# EAGLE design humidor_controller_v33 (EAGLE 6.2)
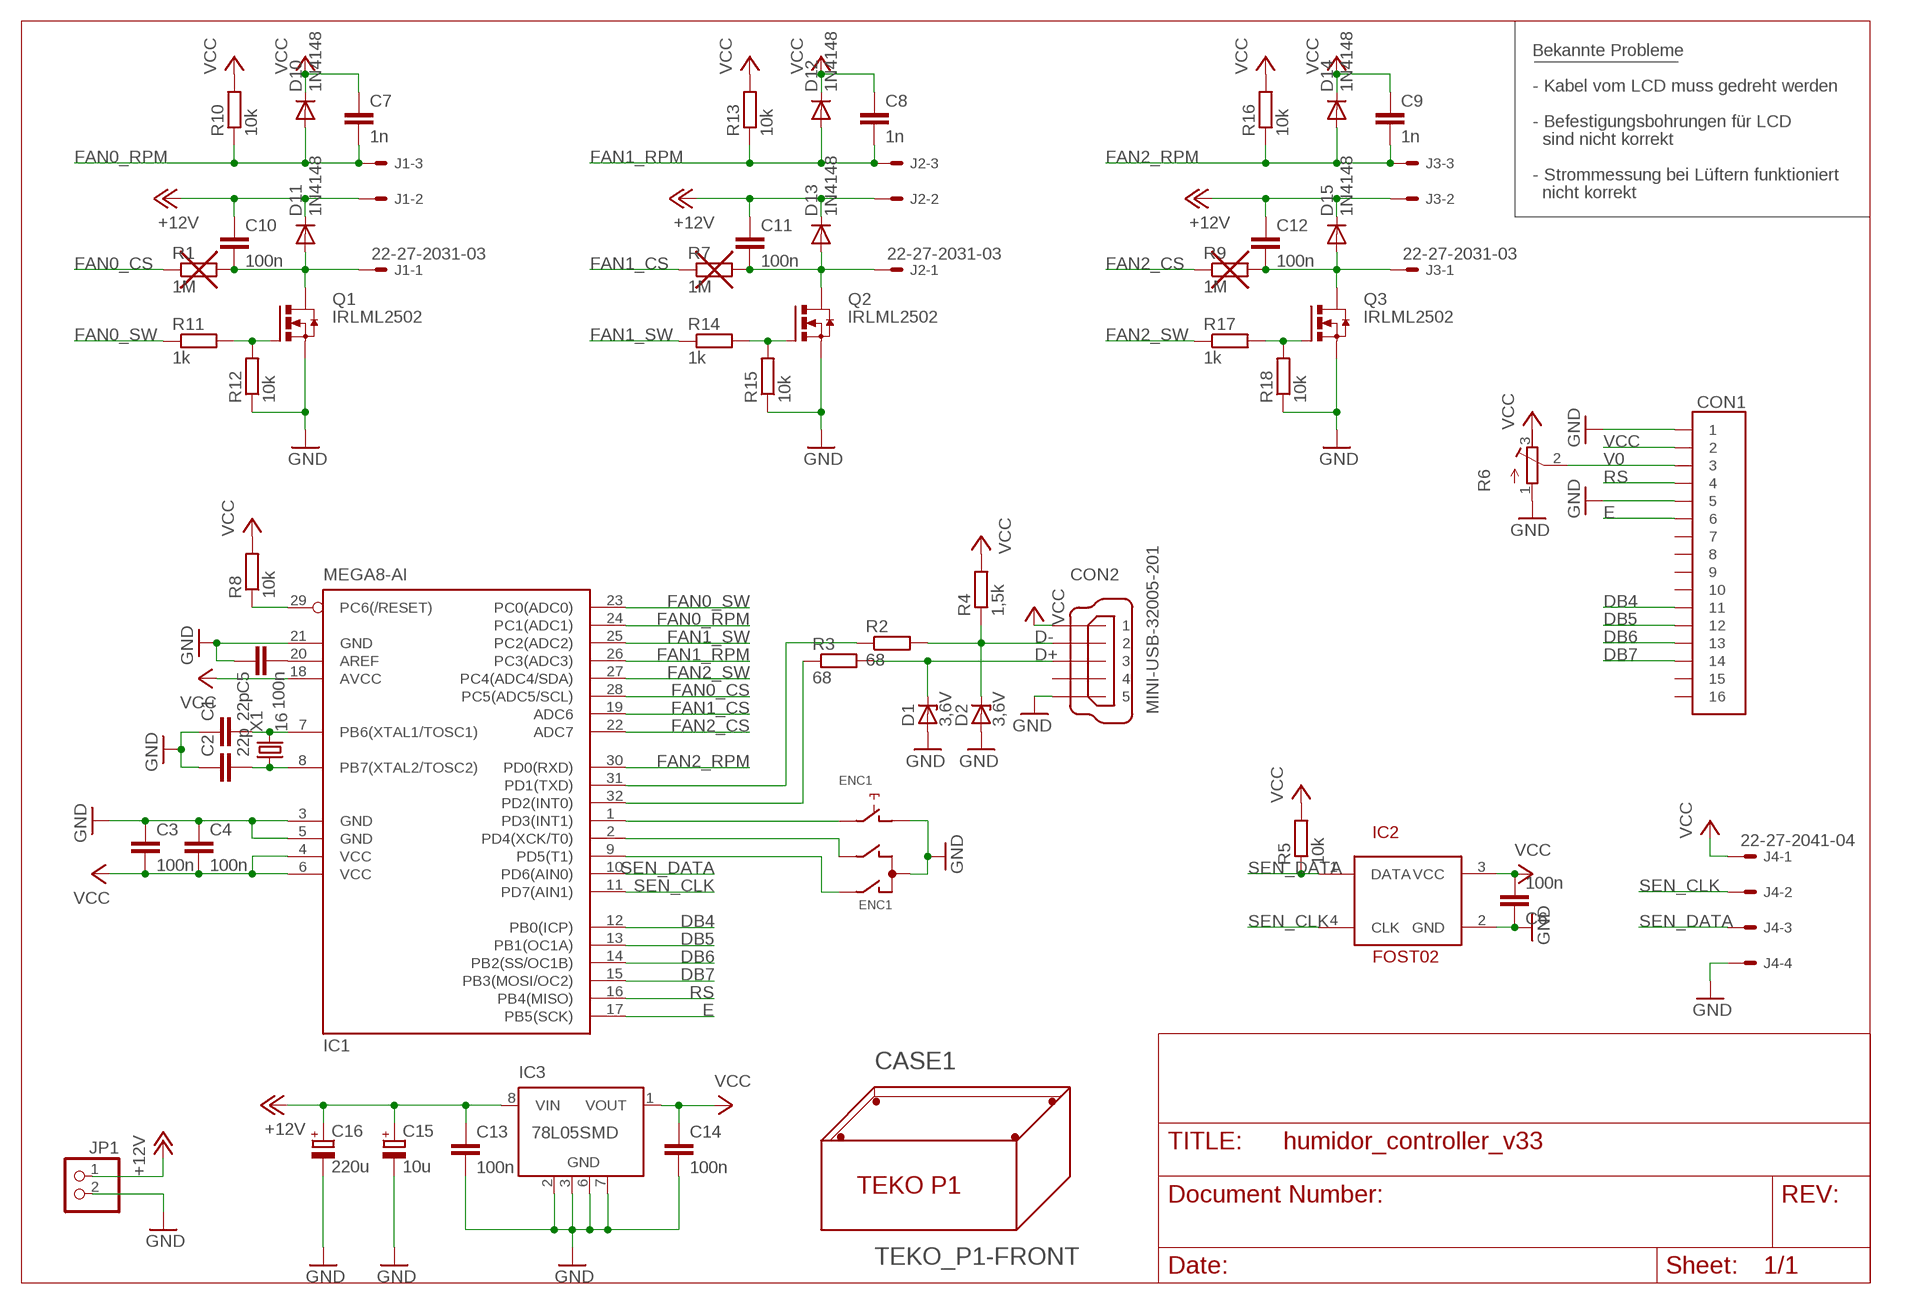
[diagram p0: schematic, sheet 1]

## Parts
C1  22p  C-EUC0805  [C0805]
C2  22p  C-EUC0805  [C0805]
C3  100n  C-EUC0805  [C0805]
C4  100n  C-EUC0805  [C0805]
C5  100n  C-EUC0805  [C0805]
C6  100n  C-EUC0805  [C0805]
C7  1n  C-EUC0805  [C0805]
C8  1n  C-EUC0805  [C0805]
C9  1n  C-EUC0805  [C0805]
C10  100n  C-EUC0805  [C0805]
C11  100n  C-EUC0805  [C0805]
C12  100n  C-EUC0805  [C0805]
C13  100n  C-EUC0805  [C0805]
C14  100n  C-EUC0805  [C0805]
C15  10u  CPOL-EUD  [PANASONIC_D]
C16  220u  CPOL-EUG  [PANASONIC_G]
CASE1  TEKO_P1-FRONT  [TEKO_P1_FRONT]
CON1  52207-16  [52207-16]
CON2  MINI-USB-32005-201  [32005-201]
D1  3,6V  ZENER-DIODESOD80C  [SOD80C]
D2  3,6V  ZENER-DIODESOD80C  [SOD80C]
D10  1N4148  DIODE-SOD323-R  [SOD323-R]
D11  1N4148  DIODE-SOD323-R  [SOD323-R]
D12  1N4148  DIODE-SOD323-R  [SOD323-R]
D13  1N4148  DIODE-SOD323-R  [SOD323-R]
D14  1N4148  DIODE-SOD323-R  [SOD323-R]
D15  1N4148  DIODE-SOD323-R  [SOD323-R]
ENC1  NOBLE_RE0124  [RE0124]
IC1  MEGA8-AI  [TQFP32-08]
IC2  FOST02  [FOST02]
IC3  78L05SMD  [SO08]
J1  22-27-2031-03  [6410-03]
J2  22-27-2031-03  [6410-03]
J3  22-27-2031-03  [6410-03]
J4  22-27-2041-04  [6410-04]
JP1  PINHD-1X2  [1X02]
Q1  IRLML2502  N-HEXFET_SOT23-IRLML2502  [SOT23]
Q2  IRLML2502  N-HEXFET_SOT23-IRLML2502  [SOT23]
Q3  IRLML2502  N-HEXFET_SOT23-IRLML2502  [SOT23]
R1  1M  R-EU_R0805  [R0805]
R2  68  R-EU_R0805  [R0805]
R3  68  R-EU_R0805  [R0805]
R4  1,5k  R-EU_R0805  [R0805]
R5  10k  R-EU_R0805  [R0805]
R6  R-TRIMM4G/J  [RTRIM4G/J]
R7  1M  R-EU_R0805  [R0805]
R8  10k  R-EU_R0805  [R0805]
R9  1M  R-EU_R0805  [R0805]
R10  10k  R-EU_R0805  [R0805]
R11  1k  R-EU_R0805  [R0805]
R12  10k  R-EU_R0805  [R0805]
R13  10k  R-EU_R0805  [R0805]
R14  1k  R-EU_R0805  [R0805]
R15  10k  R-EU_R0805  [R0805]
R16  10k  R-EU_R0805  [R0805]
R17  1k  R-EU_R0805  [R0805]
R18  10k  R-EU_R0805  [R0805]
X1  16  CRYSTALHC49UP  [HC49UP]

## Nets
+12V: C10.1 C11.1 C12.1 C13.1 C15.+ C16.+ D11.C D13.C D15.C IC3.8(VIN) J1.2 J2.2 J3.2 JP1.1
D+: CON2.3 D1.C R3.2
D-: CON2.2 D2.C R2.2 R4.1
DB4: CON1.11 IC1.12(PB0(ICP))
DB5: CON1.12 IC1.13(PB1(OC1A))
DB6: CON1.13 IC1.14(PB2(SS/OC1B))
DB7: CON1.14 IC1.15(PB3(MOSI/OC2))
E: CON1.6 IC1.17(PB5(SCK))
FAN0_CS: IC1.28(PC5(ADC5/SCL)) R1.1
FAN0_CS_: C10.2 D11.A J1.1 Q1.3(D) R1.2
FAN0_RPM: C7.2 D10.A IC1.24(PC1(ADC1)) J1.3 R10.1
FAN0_SW: IC1.23(PC0(ADC0)) R11.1
FAN1_CS: IC1.19(ADC6) R7.1
FAN1_CS_: C11.2 D13.A J2.1 Q2.3(D) R7.2
FAN1_RPM: C8.2 D12.A IC1.26(PC3(ADC3)) J2.3 R13.1
FAN1_SW: IC1.25(PC2(ADC2)) R14.1
FAN2_CS: IC1.22(ADC7) R9.1
FAN2_CS_: C12.2 D15.A J3.1 Q3.3(D) R9.2
FAN2_RPM: C9.2 D14.A IC1.30(PD0(RXD)) J3.3 R16.1
FAN2_SW: IC1.27(PC4(ADC4/SDA)) R17.1
GND: C1.1 C2.1 C3.1 C4.1 C5.1 C6.1 C13.2 C14.2 C15.- C16.- CON1.1 CON1.5 CON2.5 D1.A D2.A ENC1.+ ENC1.C IC1.3(GND) IC1.5(GND) IC1.21(GND) IC2.2(GND) IC3.2(GND) IC3.3(GND) IC3.6(GND) IC3.7(GND) J4.4 JP1.2 Q1.2(S) Q2.2(S) Q3.2(S) R6.1(E) R12.1 R15.1 R18.1
N$1: IC1.29(PC6(/RESET)) R8.1
N$2: C2.2 IC1.8(PB7(XTAL2/TOSC2)) X1.1
N$3: C1.2 IC1.7(PB6(XTAL1/TOSC1)) X1.2
N$4: Q2.1(G) R14.2 R15.2
N$5: Q3.1(G) R17.2 R18.2
N$7: C5.2 IC1.20(AREF)
N$9: Q1.1(G) R11.2 R12.2
N$11: IC1.31(PD1(TXD)) R2.1
N$13: ENC1.- IC1.1(PD3(INT1))
N$14: ENC1.B IC1.2(PD4(XCK/T0))
N$15: ENC1.A IC1.9(PD5(T1))
N$16: IC1.32(PD2(INT0)) R3.1
RS: CON1.4 IC1.16(PB4(MISO))
SEN_CLK: IC1.11(PD7(AIN1)) IC2.4(CLK) J4.2
SEN_DATA: IC1.10(PD6(AIN0)) IC2.1(DATA) J4.3 R5.1
V0: CON1.3 R6.2(S)
VCC: C3.2 C4.2 C6.2 C7.1 C8.1 C9.1 C14.1 CON1.2 CON2.1 D10.C D12.C D14.C IC1.4(VCC) IC1.6(VCC) IC1.18(AVCC) IC2.3(VCC) IC3.1(VOUT) J4.1 R4.2 R5.2 R6.3(A) R8.2 R10.2 R13.2 R16.2
Unconnected: CON1.7 CON1.8 CON1.9 CON1.10 CON1.15 CON1.16 CON2.4 IC3.4(NC) IC3.5(NC)

## Notes on the sheet
- Bekannte Probleme
- - Kabel vom LCD muss gedreht werden
- - Befestigungsbohrungen für LCD
- sind nicht korrekt
- - Strommessung bei Lüftern funktioniert
- nicht korrekt

## Library data of the parts
C1 C2 C13 C14 = rcl:C-EU: CAPACITOR, European symbol
C3-C12 = resistor:C-EU: CAPACITOR, European symbol
C15 C16 = rcl:CPOL-EU: POLARIZED CAPACITOR, European symbol
CASE1 = ferdinandkeil:TEKO_P1-: TEKO P1 Case - Serie Optative 85 x 56 x 35 mm
CON1 = jt-con-molex:52207-16: Molex 52207-16 top-connection FPC 1mm
CON2 = con-cypressindustries:MINI-USB-: MINI USB-B Conector Source: www.cypressindustries.com
D1 D2 = diode:ZENER-DIODE: Z-Diode
D10-D15 = ferdinandkeil:DIODE-: DIODE
ENC1 = ferdinandkeil:NOBLE_RE0124: NOBLE RE0124 Rotary Encoder w/ Push-Button
IC1 = atmel:MEGA8: MICROCONTROLLER 8 Kbytes FLASH, 1 kbytes SRAM, 512 bytes EEPROM, USART, 6-channel 10 bit ADC, 2-channel 8 bit ADC Pin compatible with Atmega48, ATMega88, ATMega168 Source: avr.lbr
IC2 = ferdinandkeil:FOST02
IC3 = linear:78L*SMD: Positive VOLTAGE REGULATOR
J1-J3 = con-molex:22-?-03: CONNECTOR wire to board 2.54 mm (.1 inch) pitch header
J4 = con-molex:22-?-04: CONNECTOR wire to board 2.54 mm (.1 inch) pitch header
JP1 = pinhead:PINHD-1X2: PIN HEADER
Q1-Q3 = ferdinandkeil:N-HEXFET_?-*: HEXFET® Power MOSFET
R1-R5 R7-R18 = resistor:R-EU_: RESISTOR, European symbol
R6 = rcl:R-TRIMM: Trimm resistor
X1 = crystal:CRYSTAL: CRYSTAL

## Board
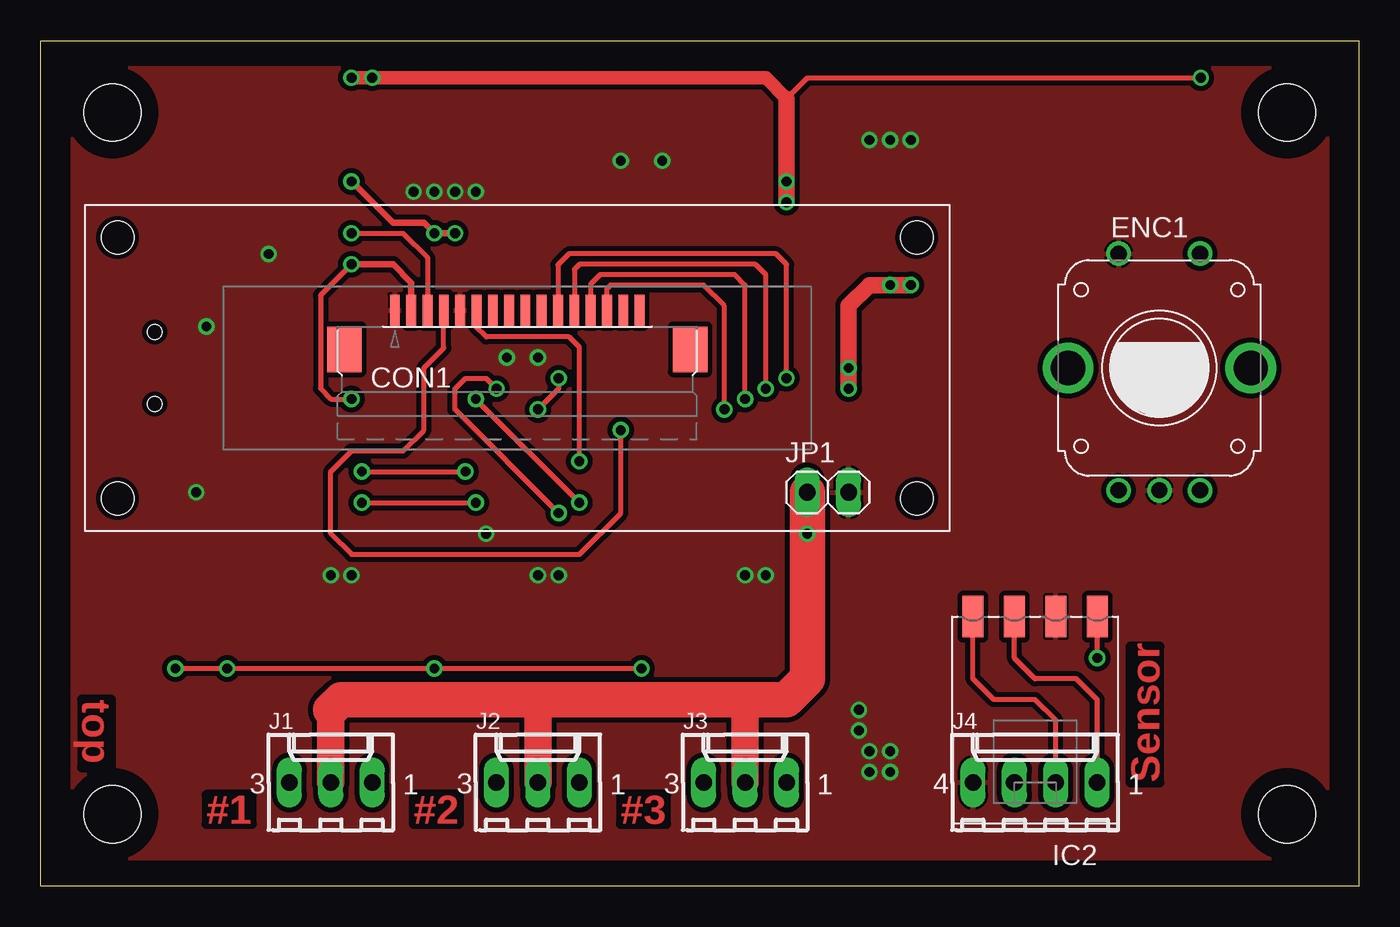
[diagram p1: board, top side]
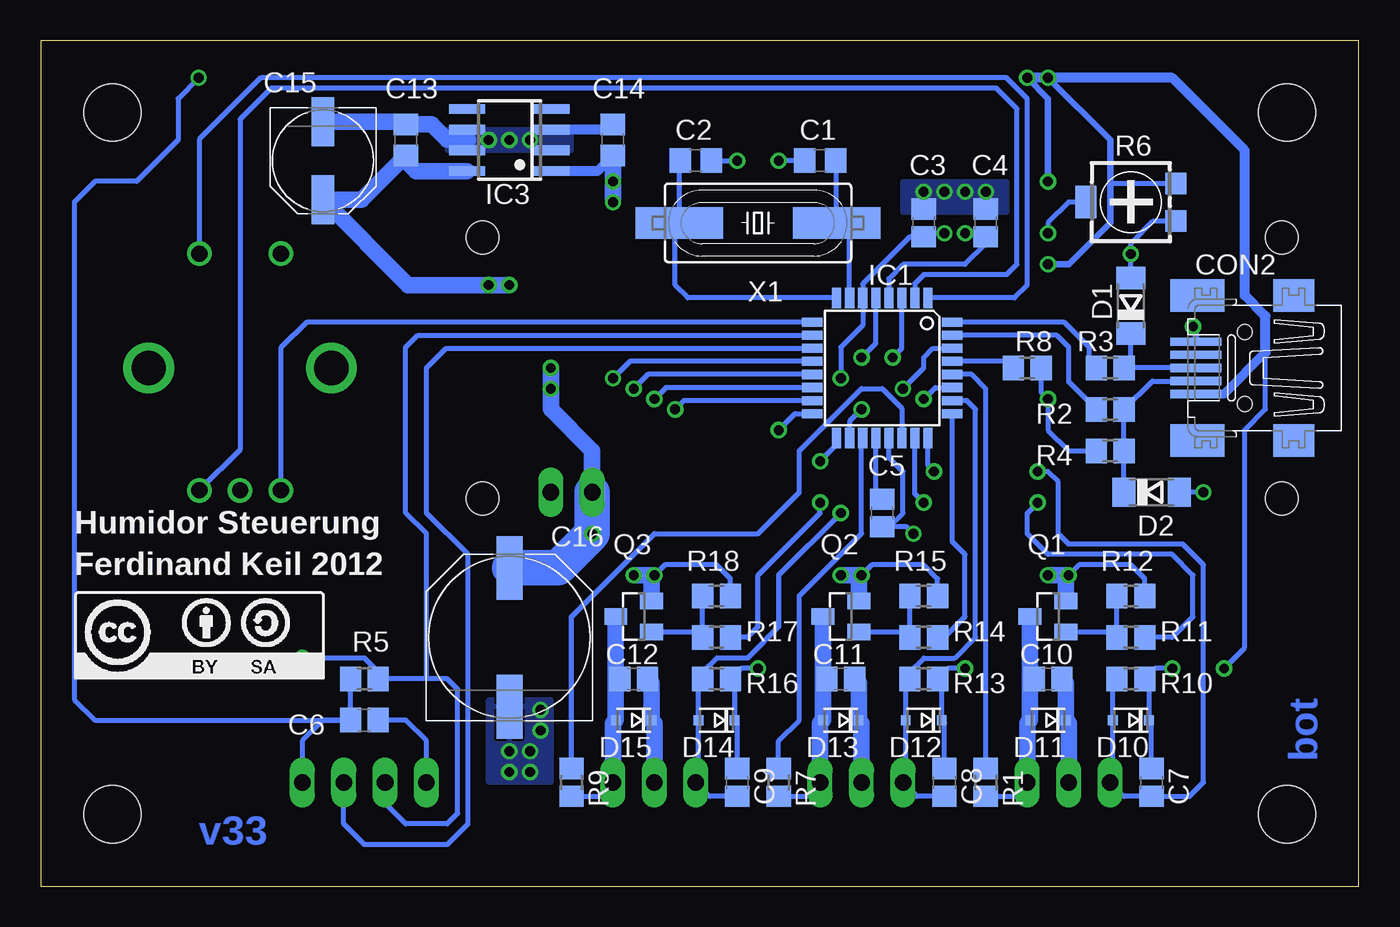
[diagram p2: board, bottom side, seen from below]

Size 80.8 x 51.8 mm. Coordinates in mm from the lower left corner, seen from the top.
Copper layers (1*16): Top 0.035mm / dielectric 1.5mm / Bottom 0.035mm
Design rules: minimum track width 0.15mm, minimum drill 0.3mm, track to track 0.15mm, track to pad 0.15mm, pad to pad 0.15mm, via to via 0.15mm, smd to smd 0mil, copper to edge 0.2mm, drill to drill 0.2mm, minimum pad ring 0.2mm, minimum via ring 0.2mm, stop-mask expansion 4mil, vias tented up to drill 0.8mm, thermal gap 0.15mm

### Footprints (pad centres in the part's own frame; a part is rotated, then mirrored left to right if it is on the bottom)
C0805 = smd 1.3 x 1.5: 1 -0.95,0; 2 0.95,0
C0805' = smd 1.3 x 1.5: 1 -0.85,0; 2 0.85,0
PANASONIC_D = smd 3 x 1.4: + 2.4,0; - -2.4,0
PANASONIC_G = smd 3.9 x 1.6: + 4.25,0; - -4.25,0
TEKO_P1_FRONT = hole 3.5: 4.4,4.4; 4.4,47.4; 76.4,4.4; 76.4,47.4
52207-16 = smd 0.6 x 1.9: 1 -7.5,1; 2 -6.5,1; 3 -5.5,1; 4 -4.5,1; 5 -3.5,1; 6 -2.5,1; 7 -1.5,1; 8 -0.5,1; 9 0.5,1; 10 1.5,1; 11 2.5,1; 12 3.5,1; 13 4.5,1; 14 5.5,1; 15 6.5,1; 16 7.5,1 | smd 2.1 x 2.8: P$1 -10.6,-1.4; P$2 10.6,-1.4
32005-201 = smd 3.1 x 0.5: 1 3,1.6; 2 3,0.8; 3 3,0; 4 3,-0.8; 5 3,-1.6 | smd 2.5 x 2: M1 -3,-4.45; M2 -3,4.45 | smd 3.3 x 2: M3 2.9,4.45; M4 2.9,-4.45 | hole 0.9: 0,2.2; 0,-2.2
SOD80C = smd 1.4 x 1.8: A 1.7,0; C -1.7,0
SOD323-R = smd 0.6 x 0.6: A 1.1,0; C -1.1,0
RE0124 = drill 1: + -2.5,7; - 2.5,7; A -2.5,-7.5; B 2.5,-7.5; C 0,-7.5 | drill 2.1: P$1 5.6,0; P$2 -5.6,0
TQFP32-08 = smd 1.27 x 0.559: 1 -4.293,2.8; 2 -4.293,2; 3 -4.293,1.2; 4 -4.293,0.4; 5 -4.293,-0.4; 6 -4.293,-1.2; 7 -4.293,-2; 8 -4.293,-2.8; 17 4.293,-2.8; 18 4.293,-2; 19 4.293,-1.2; 20 4.293,-0.4; 21 4.293,0.4; 22 4.293,1.2; 23 4.293,2; 24 4.293,2.8 | smd 0.559 x 1.27: 9 -2.8,-4.293; 10 -2,-4.293; 11 -1.2,-4.293; 12 -0.4,-4.293; 13 0.4,-4.293; 14 1.2,-4.293; 15 2,-4.293; 16 2.8,-4.293; 25 2.8,4.293; 26 2,4.293; 27 1.2,4.293; 28 0.4,4.293; 29 -0.4,4.293; 30 -1.2,4.293; 31 -2,4.293; 32 -2.8,4.293
FOST02 = smd 1.27 x 2.54: 1 -3.81,-10.16; 2 -1.27,-10.16; 3 1.27,-10.16; 4 3.81,-10.16
SO08 = smd 0.6 x 2.2: 1 -1.905,-2.6; 2 -0.635,-2.6; 3 0.635,-2.6; 4 1.905,-2.6; 5 1.905,2.6; 6 0.635,2.6; 7 -0.635,2.6; 8 -1.905,2.6
6410-03 = drill 1.016 long: 1 2.54,0; 2 0,0; 3 -2.54,0
6410-04 = drill 1.016 long: 1 3.81,0; 2 1.27,0; 3 -1.27,0; 4 -3.81,0
1X02 = drill 1.016 long: 1 -1.27,0; 2 1.27,0
SOT23 = smd 1 x 1.4: 1 -0.95,-1.1; 2 0.95,-1.1; 3 0,1.1
R0805 = smd 1.3 x 1.5: 1 -0.85,0; 2 0.85,0
RTRIM4G/J = smd 1.3 x 1.3: 1 -1.15,-2.75; 3 1.15,-2.75 | smd 2 x 1.3: 2 0,2.75
LCD_HMC16223SG = hole 2: -24.5,-8; -24.5,8; 24.5,8; 24.5,-8
HC49UP = smd 5.334 x 1.93: 1 -4.826,0; 2 4.826,0

### Placement (x,y rotation side)
C1  33.02,44.45 0 bottom
C2  40.64,44.45 180 bottom
C3  100n  [C0805']  26.67,40.64 270 bottom
C4  100n  [C0805']  22.86,40.64 270 bottom
C5  100n  [C0805']  29.21,22.86 90 bottom
C6  100n  [C0805']  60.96,10.16 180 bottom
C7  1n  [C0805']  12.7,6.35 270 bottom
C8  1n  [C0805']  25.4,6.35 270 bottom
C9  1n  [C0805']  38.1,6.35 270 bottom
C10  100n  [C0805']  19.05,12.7 180 bottom
C11  100n  [C0805']  31.75,12.7 180 bottom
C12  100n  [C0805']  44.45,12.7 180 bottom
C13  58.42,45.72 90 bottom
C14  45.72,45.72 90 bottom
C15  63.5,44.45 270 bottom
C16  52.07,15.24 90 bottom
CASE1  0,0 0 top
CON1  29.21,34.29 0 top
CON2  6.99,31.75 180 bottom
D1  13.97,35.56 90 bottom
D2  12.7,24.13 0 bottom
D10  13.97,10.16 180 bottom
D11  19.05,10.16 180 bottom
D12  26.67,10.16 180 bottom
D13  31.75,10.16 180 bottom
D14  39.37,10.16 180 bottom
D15  44.45,10.16 180 bottom
ENC1  68.58,31.75 0 top
IC1  29.21,31.75 270 bottom
IC2  60.96,6.35 180 top
IC3  52.07,45.72 90 bottom
J1  17.78,6.35 0 top
J2  30.48,6.35 0 top
J3  43.18,6.35 0 top
J4  60.96,6.35 0 top
JP1  48.26,24.13 0 top
Q1  19.05,16.51 90 bottom
Q2  31.75,16.51 90 bottom
Q3  44.45,16.51 90 bottom
R1  22.86,6.35 270 bottom
R2  15.24,29.21 0 bottom
R3  15.24,31.75 0 bottom
R4  15.24,26.67 180 bottom
R5  60.96,12.7 180 bottom
R6  13.97,41.91 90 bottom
R7  35.56,6.35 270 bottom
R8  20.32,31.75 0 bottom
R9  48.26,6.35 270 bottom
R10  13.97,12.7 0 bottom
R11  13.97,15.24 180 bottom
R12  13.97,17.78 180 bottom
R13  26.67,12.7 0 bottom
R14  26.67,15.24 180 bottom
R15  26.67,17.78 180 bottom
R16  39.37,12.7 0 bottom
R17  39.37,15.24 180 bottom
R18  39.37,17.78 180 bottom
U$1  [LCD_HMC16223SG]  29.21,31.75 0 top
U$2  [CC-BY-SA]  78.74,12.7 0 bottom
X1  36.83,40.64 0 bottom

### Tracks (layer width: path | path; a pad name or v marks a point on that pad's centre or on a via)
+12V  (via drill 0.6)
  Top 1.016: v53.34,36.83 v52.07,36.83 50.8,36.83 49.53,35.56 v49.53,31.75 v49.53,30.48
  Top 1.676: 18.41,11.43 18.41,11.26 30.48,11.26 | 30.65,11.43 30.48,11.26 | 30.48,11.26 J2.2 | 43.18,11.43 J3.2 | J1.2 17.78,10.79
  Top 2.184: 17.78,10.79 18.41,11.43 30.65,11.43 43.18,11.43 45.72,11.43 46.99,12.7 v46.99,21.59 JP1.1
  Bottom 1.016: J1.2 17.78,9.99 D11.C 17.95,12.45 C10.1 | J2.2 30.48,9.99 D13.C 30.65,12.45 C11.1 | J3.2 43.18,9.99 D15.C 43.35,12.45 C12.1 | IC3.8 57.78,43.81 58.42,44.45 C13.1 61.14,42.05 C15.+ 58.28,36.83 v52.07,36.83 | JP1.1 46.99,26.67 49.53,29.21 v49.53,30.48 v49.53,31.75
  Bottom 2.184: C16.+ 49.09,19.49 v46.99,21.59 JP1.1
D+
  Bottom 0.305: CON2.3 R3.2 13.97,31.75 D1.C
D-
  Bottom 0.305: CON2.2 12.65,30.95 R2.2 R4.1 D2.C
DB4  (via drill 0.6)
  Top 0.305: v45.72,31.11 45.72,38.1 45.09,38.73 32.38,38.73 31.71,38.06 CON1.11
  Bottom 0.305: IC1.12 44.69,32.15 v45.72,31.11
DB5  (via drill 0.6)
  Top 0.305: v44.45,30.48 44.45,37.47 43.81,38.1 33.02,38.1 32.71,37.79 CON1.12
  Bottom 0.305: IC1.13 43.58,31.35 v44.45,30.48
DB6  (via drill 0.6)
  Top 0.305: v43.18,29.84 43.18,36.83 42.55,37.47 34.29,37.47 33.71,36.88 CON1.13
  Bottom 0.305: IC1.14 42.48,30.55 v43.18,29.84
DB7  (via drill 0.6)
  Top 0.305: v41.91,29.21 41.91,35.56 40.64,36.83 34.92,36.83 34.71,36.62 CON1.14
  Bottom 0.305: IC1.15 41.37,29.75 v41.91,29.21
E  (via drill 0.6)
  Top 0.305: v33.02,26.04 33.02,33.02 32.38,33.66 27.3,33.66 26.67,34.29 26.67,35.25 CON1.6
  Bottom 0.305: IC1.17 32.01,27.05 v33.02,26.04
FAN0_CS
  Bottom 0.305: IC1.28 23.73,31.35 22.86,30.48 R1.1
FAN0_CS_
  Bottom 0.305: Q1.3 20.32,16.68 | R1.2 21.17,5.5 J1.1
  Bottom 1.016: J1.1 20.32,9.99 D11.A 20.15,12.7 | 20.15,12.7 Q1.3 | 20.15,12.7 C10.2
FAN0_RPM  (via drill 0.6)
  Top 0.305: v19.68,25.4 v26.04,25.4
  Bottom 0.305: R10.1 15.07,12.45 D10.A 15.07,6.52 J1.3 14.39,5.5 C7.2 10.38,5.5 9.53,6.35 9.53,19.68 10.79,20.95 17.78,20.95 18.41,21.59 18.41,24.77 19.05,25.4 v19.68,25.4 | IC1.24 26.41,25.77 v26.04,25.4
FAN0_SW  (via drill 0.6)
  Top 0.305: v19.68,23.5 v26.67,23.5
  Bottom 0.305: R11.1 11.43,15.24 10.16,16.51 10.16,19.05 11.43,20.32 19.05,20.32 20.32,21.59 20.32,22.86 v19.68,23.5 | IC1.23 27.21,24.04 v26.67,23.5
FAN1_CS
  Bottom 0.305: IC1.19 30.48,27.39 30.48,21.59 34.29,17.78 34.29,10.16 35.56,8.89 R7.1
FAN1_CS_
  Bottom 0.305: R7.2 33.87,5.5 J2.1
  Bottom 1.016: J2.1 33.02,9.99 D13.A 32.85,12.7 | 32.85,12.7 Q2.3 | 32.85,12.7 C11.2
FAN1_RPM
  Bottom 0.305: IC1.26 24.04,29.75 23.5,29.21 23.5,15.24 24.77,13.97 26.67,13.97 27.52,13.12 R13.1 27.77,12.45 D12.A 27.77,6.52 J2.3 27.09,5.5 C8.2
FAN1_SW
  Bottom 0.305: R14.1 25.4,15.24 24.13,16.51 24.13,20.32 24.92,21.11 IC1.25
FAN2_CS
  Bottom 0.305: IC1.22 28.01,29.28 29.21,30.48 30.48,30.48 34.29,26.67 34.29,24.13 36.83,21.59 43.18,21.59 48.26,16.51 R9.1
FAN2_CS_
  Bottom 0.305: R9.2 46.57,5.5 J3.1
  Bottom 1.016: J3.1 45.72,9.99 D15.A 45.55,12.7 | 45.55,12.7 Q3.3 | 45.55,12.7 C12.2
FAN2_RPM  (via drill 0.6)
  Top 0.305: v31.75,22.86 25.4,29.21 25.4,30.48 26.04,31.11 27.3,31.11 v27.94,30.48
  Bottom 0.305: IC1.30 26.11,32.95 26.67,32.38 26.67,31.75 v27.94,30.48 | v31.75,22.86 35.56,19.05 35.56,15.88 37.47,13.97 39.37,13.97 40.22,13.12 R16.1 40.47,12.45 D14.A 40.47,6.52 J3.3 39.79,5.5 C9.2
FAN2_SW  (via drill 0.6)
  Top 0.305: v33.02,23.5 v26.67,29.84
  Bottom 0.305: IC1.27 25.96,30.55 v26.67,29.84 | v33.02,23.5 33.02,22.86 36.83,19.05 36.83,15.88 37.47,15.24 R17.1
GND  (via drill 0.6)
  Bottom 0.305: R12.1 13.12,18.84 13.97,19.68 17.14,19.68 v17.78,19.05 | R15.1 25.82,18.84 26.67,19.68 29.84,19.68 v30.48,19.05 | R18.1 38.52,18.84 39.37,19.68 42.55,19.68 v43.18,19.05 | IC1.21 28.81,26.27 27.94,25.4 27.94,22.86 28.79,22.01 C5.1 27.73,22.01 v27.3,21.59 | IC1.3 28.01,32.95 v28.57,32.38 | IC1.5 29.61,33.26 v30.48,32.38 | 59.69,9.74 C6.1 58.42,10.16 57.15,8.89 J4.4 | 13.97,36.83 D1.A v13.97,38.73 13.97,39.37 12.58,40.76 R6.1 | v9.53,24.13 D2.A | C1.1 v35.56,44.45 | C2.1 v38.1,44.45
  Bottom 0.406: CON2.5 9.98,34.12 v10.16,34.29
  Bottom 0.61: IC3.3 46.03,46.35 C14.2
  Bottom 1.016: Q2.2 30.65,18.88 v30.48,19.05 v31.75,19.05 | Q1.2 17.95,18.88 v17.78,19.05 v19.05,19.05 | Q3.2 43.35,18.88 v43.18,19.05 v44.45,19.05 | C15.- 58.6,46.85 C13.2 56.83,46.67 55.88,45.72 54.61,45.72
  other vias: 22.86,42.55 24.13,42.55 25.4,42.55 26.67,42.55 50.8,45.72 52.07,45.72 53.34,45.72 50.16,10.79 50.8,8.26 52.07,8.26 50.16,9.53 50.8,6.99 52.07,6.99
  pour Top (isolate 0.305): -1.27,53.34 82.55,53.34 82.55,-1.27 -1.27,-1.27
  pour Bottom (isolate 0.305, no thermals): 21.59,43.18 21.59,41.27 27.94,41.27 27.94,43.18
  pour Bottom (no thermals): 48.26,46.35 55.88,46.35 55.88,45.09 48.26,45.09
  pour Bottom (isolate 0.305): 53.34,11.43 49.53,11.43 49.53,6.35 53.34,6.35
N$1
  Bottom 0.305: IC1.29 21.57,32.15 R8.1
N$2
  Bottom 0.305: IC1.8 41.12,36.04 41.91,36.83 41.91,40.39 X1.1 41.66,44.38 C2.2
N$3
  Bottom 0.305: IC1.7 31.21,40.1 31.75,40.64 X1.2 32,44.38 C1.2
N$4
  Bottom 0.305: Q2.1 27.84,15.56 R14.2 R15.2
N$5
  Bottom 0.305: R18.2 R17.2 40.54,15.56 Q3.1
N$7
  Bottom 0.305: IC1.20 29.61,24.11 C5.2
N$9
  Bottom 0.305: Q1.1 15.14,15.56 R11.2 R12.2
N$11
  Bottom 0.305: R2.1 17.78,30.9 17.78,33.02 18.51,33.75 IC1.31
N$13
  Bottom 0.305: ENC1.- 71.08,45.76 67.31,49.53 21.59,49.53 20.32,48.26 20.32,36.83 21.11,36.04 IC1.1
N$14
  Bottom 0.305: IC1.2 27.21,36.92 26.67,37.47 21.59,37.47 20.95,38.1 20.95,47.62 22.23,48.9 66.67,48.9 68.58,46.99 68.58,26.75 ENC1.B
N$15
  Bottom 0.305: IC1.9 64.51,34.55 66.08,32.98 ENC1.A
N$16
  Bottom 0.305: IC1.32 18.04,34.55 16.51,33.02 16.51,32.17 R3.1
RS  (via drill 0.6)
  Top 0.305: v35.56,27.94 35.56,22.86 33.02,20.32 19.05,20.32 17.78,21.59 17.78,25.4 19.05,26.67 22.23,26.67 23.5,27.94 23.5,31.75 24.71,32.97 CON1.4
  Bottom 0.305: IC1.16 34.55,28.95 v35.56,27.94
SEN_CLK
  Top 0.305: J4.2 62.23,10.16 60.96,11.43 58.42,11.43 57.15,12.7 IC2.4
  Bottom 0.305: IC1.11 55.95,32.95 57.15,31.75 57.15,22.86 54.61,20.32 54.61,3.81 55.88,2.54 60.96,2.54 62.23,3.81 J4.2
SEN_DATA  (via drill 0.6)
  Top 0.305: v64.77,13.97 IC2.1
  Bottom 0.305: 57.15,12.7 57.15,21.59 58.42,22.86 58.42,33.02 57.69,33.75 IC1.10 | 57.15,12.7 R5.1 60.11,13.12 60.96,13.97 v64.77,13.97 | J4.3 59.69,5.08 58.42,3.81 55.88,3.81 55.24,4.45 55.24,12.06 55.88,12.7 57.15,12.7
V0  (via drill 0.6)
  Top 0.305: v19.05,40.01 22.23,40.01 23.71,38.52 CON1.3
  Bottom 0.305: R6.2 17.78,41.91 19.05,40.64 v19.05,40.01
VCC  (via drill 0.6)
  Top 0.305: v36.83,13.34 v24.13,13.34 v11.43,13.34 v8.26,13.34 | v19.05,29.84 17.78,29.84 17.14,30.48 17.14,36.2 v19.05,38.1 | v71.12,49.53 46.99,49.53 45.72,48.26 | v31.75,31.11 31.75,30.48 v30.48,29.21 | IC2.3 59.69,13.97 60.96,12.7 63.5,12.7 64.77,11.43 J4.1
  Top 0.406: v19.05,38.1 21.59,38.1 22.71,36.98 CON1.2 | v19.05,43.18 21.59,40.64 23.5,40.64 v24.13,40.01 v25.4,40.01
  Top 0.813: 45.72,48.26 44.45,49.53 v20.32,49.53 v19.05,49.53
  Top 1.016: 45.72,48.26 v45.72,41.91
  Bottom 0.305: 38.27,12.45 D14.C 38.1,9.99 C9.1 | 38.27,12.45 R16.2 37.88,13.34 v36.83,13.34 | IC1.4 28.81,37.23 27.94,38.1 24.13,38.1 22.86,39.37 C4.2 22.86,40.01 v24.13,40.01 | 25.57,12.45 D12.C 25.4,9.99 C8.1 | 25.57,12.45 R13.2 25.18,13.34 v24.13,13.34 | IC1.18 31.21,28.48 v30.48,29.21 | C6.2 62.23,9.74 | R8.2 19.47,30.27 v19.05,29.84 19.05,27.94 17.78,26.67 R4.2 | 61.81,10.58 62.23,10.16 | v71.12,49.53 72.39,48.26 72.39,45.72 74.93,43.18 77.47,43.18 78.74,41.91 78.74,11.43 77.47,10.16 C6.2 | 38.27,12.53 38.27,12.45 | 25.57,12.53 25.57,12.45 | v31.75,31.11 31.75,33.02 30.41,34.36 IC1.6 30.41,36.9 27.52,39.79 C3.2 26.67,40.01 v25.4,40.01 | R6.3 15.12,43.06 15.24,43.18 | v8.26,13.34 6.99,14.61 6.99,27.94 5.71,29.21 5.71,32.7 | C6.2 63.5,10.16 64.77,8.89 J4.1 | 61.81,10.58 R5.2 | C6.2 61.81,10.58 | C7.1 12.7,9.99 D10.C 12.87,12.45 R10.2 12.48,13.34 v11.43,13.34
  Bottom 0.406: v19.05,43.18 19.05,48.26 v20.32,49.53 | v19.05,38.1 17.78,38.1 15.24,40.64 15.24,43.18 15.24,45.72 v19.05,49.53
  Bottom 0.508: CON2.1 8.27,30.15 5.71,32.7
  Bottom 0.61: IC3.1 46.67,43.81 C14.1 | v20.32,49.53 v19.05,49.53 11.43,49.53 6.99,45.09 6.99,36.2 5.71,34.92 5.71,32.7
  Bottom 1.016: C14.1 v45.72,43.18 v45.72,41.91

### Text on the board
Top: top | Sensor | #1 | #2 | #3
Bottom: bot | v33
bPlace: Humidor Steuerung | Ferdinand Keil 2012